# EAGLE schematic PCB_schematic_v1.0 (EAGLE 8.0.0)
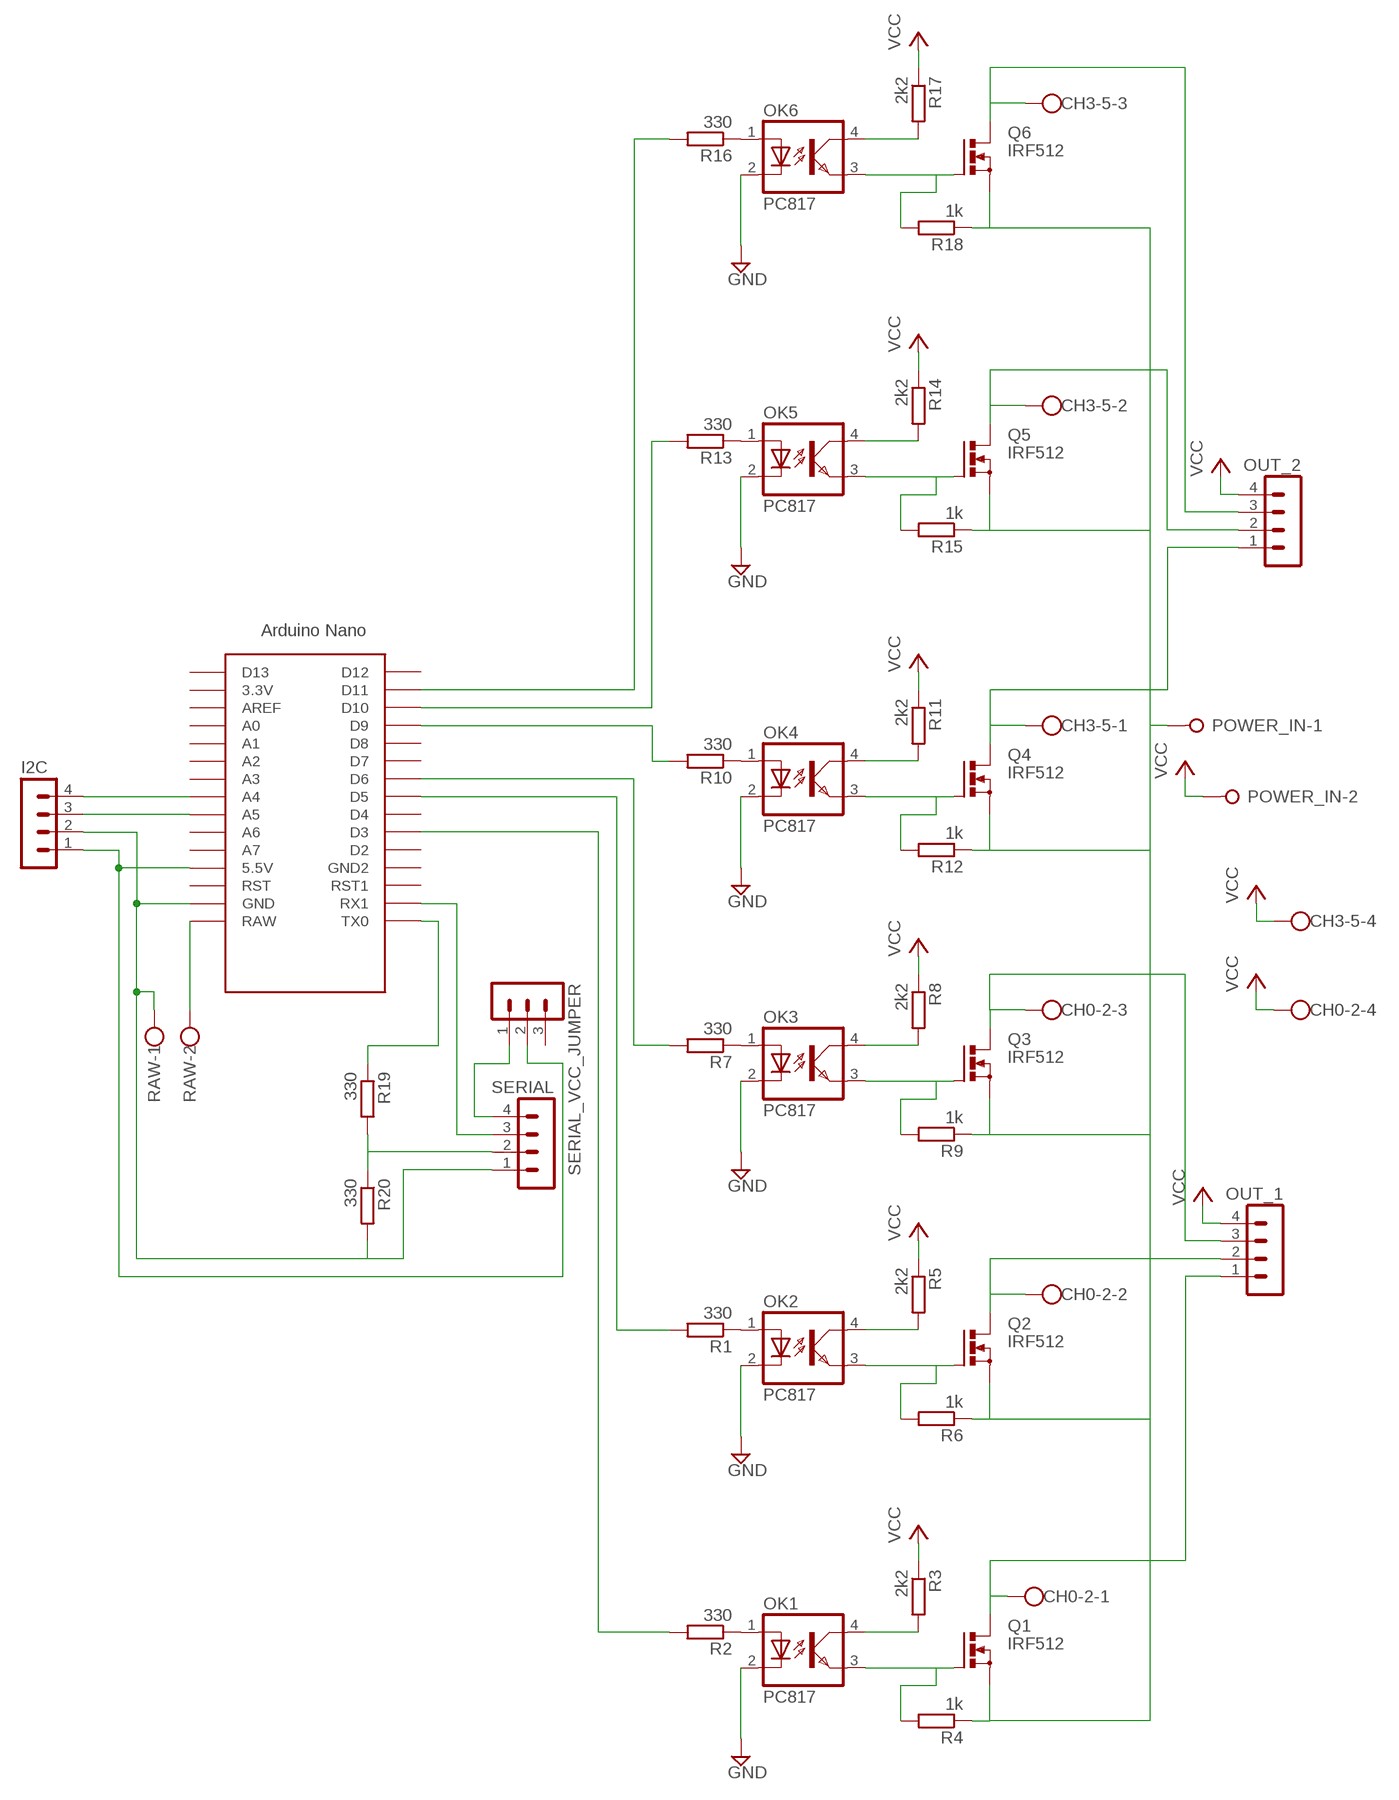
[diagram p0: schematic, sheet 1]

## Parts
CH0-2  W237-4  [W237-4]
CH3-5  W237-4  [W237-4]
I2C  MA04-1  [MA04-1]
OK1  PC817  [DIL04]
OK2  PC817  [DIL04]
OK3  PC817  [DIL04]
OK4  PC817  [DIL04]
OK5  PC817  [DIL04]
OK6  PC817  [DIL04]
OUT_1  MA04-1  [MA04-1]
OUT_2  MA04-1  [MA04-1]
POWER_IN  W237-02P  [W237-132]
Q1  IRF512  [TO220BV]
Q2  IRF512  [TO220BV]
Q3  IRF512  [TO220BV]
Q4  IRF512  [TO220BV]
Q5  IRF512  [TO220BV]
Q6  IRF512  [TO220BV]
R1  330  R-EU_0207/10  [0207/10]
R2  330  R-EU_0207/10  [0207/10]
R3  2k2  R-EU_0207/10  [0207/10]
R4  1k  R-EU_0207/10  [0207/10]
R5  2k2  R-EU_0207/10  [0207/10]
R6  1k  R-EU_0207/10  [0207/10]
R7  330  R-EU_0207/10  [0207/10]
R8  2k2  R-EU_0207/10  [0207/10]
R9  1k  R-EU_0207/10  [0207/10]
R10  330  R-EU_0207/10  [0207/10]
R11  2k2  R-EU_0207/10  [0207/10]
R12  1k  R-EU_0207/10  [0207/10]
R13  330  R-EU_0207/10  [0207/10]
R14  2k2  R-EU_0207/10  [0207/10]
R15  1k  R-EU_0207/10  [0207/10]
R16  330  R-EU_0207/10  [0207/10]
R17  2k2  R-EU_0207/10  [0207/10]
R18  1k  R-EU_0207/10  [0207/10]
R19  330  R-EU_0207/10  [0207/10]
R20  330  R-EU_0207/10  [0207/10]
RAW  W237-102  [W237-102]
SERIAL  MA04-1  [MA04-1]
SERIAL_VCC_JUMPER  MA03-1  [MA03-1]
U$1  NANO  [NANO]

## Nets
EXT_GND: POWER_IN.1 Q1.S Q2.S Q3.S Q4.S Q5.S Q6.S R4.1 R6.1 R9.1 R12.1 R15.1 R18.1
EXT_VCC_12V: CH0-2.4 CH3-5.4 OUT_1.4 OUT_2.4 POWER_IN.2 R3.1 R5.1 R8.1 R11.1 R14.1 R17.1 ; supply symbol labelled VCC
FET0_GATE: OK1.3(EMIT) Q1.G R4.2
FET0_GATE1: OK2.3(EMIT) Q2.G R6.2
FET0_GATE2: OK3.3(EMIT) Q3.G R9.2
FET0_GATE3: OK4.3(EMIT) Q4.G R12.2
FET0_GATE4: OK5.3(EMIT) Q5.G R15.2
FET0_GATE5: OK6.3(EMIT) Q6.G R18.2
GND: OK1.2(C) OK2.2(C) OK3.2(C) OK4.2(C) OK5.2(C) OK6.2(C)
IC_GND: I2C.2 R20.2 RAW.1 SERIAL.1 U$1.GND
IC_PWM_OUT_0: R2.2 U$1.D3
IC_PWM_OUT_0_BASE: OK1.1(A) R2.1
IC_PWM_OUT_0_BASE1: OK2.1(A) R1.1
IC_PWM_OUT_0_BASE2: OK3.1(A) R7.1
IC_PWM_OUT_0_BASE3: OK4.1(A) R10.1
IC_PWM_OUT_0_BASE4: OK5.1(A) R13.1
IC_PWM_OUT_0_BASE5: OK6.1(A) R16.1
IC_PWM_OUT_1: R1.2 U$1.D5
IC_PWM_OUT_2: R7.2 U$1.D6
IC_PWM_OUT_3: R10.2 U$1.D9
IC_PWM_OUT_4: R13.2 U$1.D10
IC_PWM_OUT_5: R16.2 U$1.D11
IC_VCC_5V: I2C.1 SERIAL_VCC_JUMPER.2 U$1.5V(5.5V)
N$1: OK1.4(COL) R3.2
N$2: SERIAL.4 SERIAL_VCC_JUMPER.1
N$3: OK2.4(COL) R5.2
N$5: OK3.4(COL) R8.2
N$7: OK4.4(COL) R11.2
N$9: OK5.4(COL) R14.2
N$11: OK6.4(COL) R17.2
OUTPUT_0: CH0-2.1 OUT_1.1 Q1.D
OUTPUT_1: CH0-2.2 OUT_1.2 Q2.D
OUTPUT_2: CH0-2.3 OUT_1.3 Q3.D
OUTPUT_3: CH3-5.1 OUT_2.1 Q4.D
OUTPUT_4: CH3-5.2 OUT_2.2 Q5.D
OUTPUT_5: CH3-5.3 OUT_2.3 Q6.D
RAW_IN: RAW.2 U$1.RAW
RX: SERIAL.3 U$1.RX1
SCL: I2C.3 U$1.A5
SDA: I2C.4 U$1.A4
TX_3,3V: R19.2 R20.1 SERIAL.2
TX_5V: R19.1 U$1.TX0
Unconnected: SERIAL_VCC_JUMPER.3 U$1.3.3V U$1.A0 U$1.A1 U$1.A2 U$1.A3 U$1.A6 U$1.A7 U$1.AREF U$1.D2 U$1.D4 U$1.D7 U$1.D8 U$1.D12 U$1.D13 U$1.GND1(GND2) U$1.ICSP1 U$1.ICSP2 U$1.ICSP3 U$1.ICSP4 U$1.ICSP5 U$1.ICSP6 U$1.RST U$1.RST1

## Library data of the parts
CH0-2 CH3-5 = con-wago-500:W237-4: WAGO SCREW CLAMP; OC_FARNELL: unknown; OC_NEWARK: unknown
I2C OUT_1 OUT_2 SERIAL = con-lstb:MA04-1: PIN HEADER; OC_FARNELL: unknown; OC_NEWARK: unknown
OK1-OK6 = optocoupler:PC817: SHARP OPTO COUPLER; MPN: PC817X4J000F; OC_FARNELL: 9707727; OC_NEWARK: 97K7059
POWER_IN = con-wago-508:W237-02P: WAGO SREW CLAMP; OC_FARNELL: unknown; OC_NEWARK: unknown
Q1-Q6 = transistor-power:IRF512: N-CHANNEL MOS FET
R1-R20 = rcl:R-EU_: RESISTOR, European symbol
RAW = con-wago-500:W237-102: WAGO SCREW CLAMP; MPN: 237-102; OC_FARNELL: unknown; OC_NEWARK: 70K9898
SERIAL_VCC_JUMPER = con-lstb:MA03-1: PIN HEADER; OC_FARNELL: unknown; OC_NEWARK: unknown
U$1 = Arduino-clone:NANO: Arduino Nano